# Altium schematic sheet Kajtuś-DSP_analog_out.SchDoc
size A4; DocumentNumber: 5; SheetNumber: 5; SheetTotal: 9
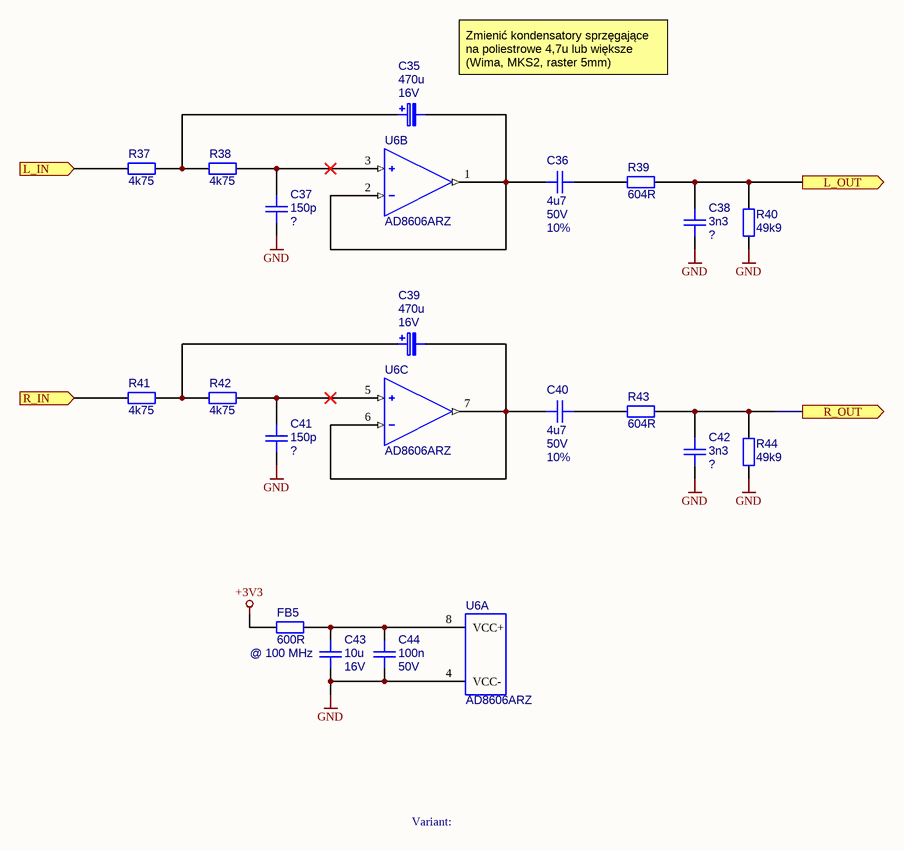
[diagram p0: Kajtuś-DSP_analog_out.SchDoc]

## Parts
C35  value 470u  Voltage: 16V  [CE_R3.5-D8-H11.5]  (hidden comment: CE_R3.5-D8-H11.5_470u_16V)
C36  Voltage: 50V  Tolerance: 10%  [C_R5-L7.2-W7.2-H13]  (hidden comment: 4u7)
C37  150p  [C_0603_MA]
C38  3n3  [C_0603_MA]
C39  value 470u  Voltage: 16V  [CE_R3.5-D8-H11.5]  (hidden comment: CE_R3.5-D8-H11.5_470u_16V)
C40  Voltage: 50V  Tolerance: 10%  [C_R5-L7.2-W7.2-H13]  (hidden comment: 4u7)
C41  150p  [C_0603_MA]
C42  3n3  [C_0603_MA]
C43  value 10u  Voltage: 16V  [C_0805_MA]  (hidden comment: C_0805_10u_16V_X5R)
C44  value 100n  Voltage: 50V  [C_0603_MA]  (hidden comment: C_0603_100n_50V_X7R)
FB5  value 600R  @ Frequency: @ 100 MHz  [R_0603_MA]  (hidden comment: FB_0603_PBY160808T-601Y_600R_1A)
R37  4k75  [R_1206_MA]
R38  4k75  [R_1206_MA]
R39  604R  [R_1206_MA]
R40  49k9  [R_1206_MA]
R41  4k75  [R_1206_MA]
R42  4k75  [R_1206_MA]
R43  604R  [R_1206_MA]
R44  49k9  [R_1206_MA]
U6  AD8606ARZ  [SO-8]  (parts A,B,C of 3)

## Ports
L_IN (in), L_OUT (out), R_IN (in), R_OUT (out)

## Nets
+3V3: FB5.1
GND: C37.2 C38.2 C41.2 C42.2 C43.2 C44.2 R40.2 R44.2 U6.4(VCC-)
L_IN: R37.2 ; port L_IN
L_OUT: C38.1 R39.1 R40.1 ; port L_OUT
R_IN: R41.2 ; port R_IN
R_OUT: C42.1 R43.1 R44.1 ; port R_OUT
NetC35_1: C35.1 R37.1 R38.2
NetC35_2: C35.2 C36.1 U6.1(Output) U6.2(-IN)
NetC36_2: C36.2 R39.2
NetC37_1: C37.1 R38.1 U6.3(+IN)
NetC39_1: C39.1 R41.1 R42.2
NetC39_2: C39.2 C40.1 U6.6(-IN) U6.7(Output)
NetC40_2: C40.2 R43.2
NetC41_1: C41.1 R42.1 U6.5(+IN)
NetC43_1: C43.1 C44.1 FB5.2 U6.8(VCC+)

## Notes on the sheet
- (near C35) Zmienić kondensatory sprzęgające na poliestrowe 4,7u lub większe (Wima, MKS2, raster 5mm)
- Variant:
- Title
- Size:
- Date:
- A4
- Number:
- Time:
- Revision:
- Sheet
- of
- File:

## Library data of the parts
C35 C39 = CE_R3.5-D8-H11.5_470u_16V: Kondensator elektrolityczny THD; Manufacturer: Nichicon; Vendor Part Number: UVR1C471MPD; Vendor: TME; Part Number: CE_R3.5-D8-H11.5_470u_16V; Manufacturer Part Number: UVR1C471MPD
C36 C40 = C_R5-L7.2-W7.2-H13_4u7_50V_MKS2_10%: Kondensator tworzywowy; Manufacturer: Wima; Vendor: TME; Part Number: C_R5-L7.2-W7.2-H13_4u7_50V_MKS2_10%; Value: 4u7
C37 C38 C41 C42 = C_SMD_MLCC_generic: Kondensator ceramiczny SMD; Vendor: ?; Part Number: C_SMD_MLCC_generic; Voltage: ?
  C37 C41: Value: 150p
  C38 C42: Value: 3n3
C43 = C_0805_10u_16V_X5R: Kondensator ceramiczny SMD; Vendor: TME; Part Number: C_0805_10u_16V_X5R
C44 = C_0603_100n_50V_X7R: Kondensator ceramiczny SMD; Vendor: TME; Part Number: C_0603_100n_50V_X7R
FB5 = FB_0603_PBY160808T-601Y_600R_1A: Koralik ferrytowy; Manufacturer: Yageo; Vendor: TME; Part Number: FB_0603_PBY160808T-601Y_600R_1A; Vendor Part Name: PBY160808T-601Y; Manufacturer Part Number: PBY160808T-601Y
R37-R44 = R_SMD_generic: SMD resistor; Part Number: ?; Vendor: ?; Manufacturer: ?; Tolerance: ?
  R37 R38 R41 R42: Value: 4k75
  R39 R43: Value: 604R
  R40 R44: Value: 49k9
U6 = U_AD8606ARZ: Precision, Low Noise, CMOS, Rail-to-Rail, Input/Output Operational Amplifier; Manufacturer: Analog Devices; Vendor: TME, Farnell; Manufacturer Part Number: AD8606ARZ; Vendor Part Number: *; Package: SO-8